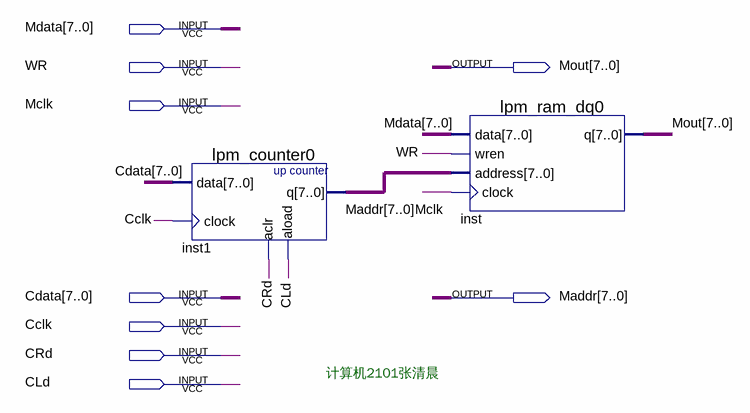
[diagram p0: schematic sheet]
// Quartus schematic RAM.bdf as structural Verilog: 2 symbols, 9 pins
module RAM (
  input  [7:0] Mdata,
  input  WR,
  input  Mclk,
  input  [7:0] Cdata,
  input  Cclk,
  input  CRd,
  input  CLd,
  output [7:0] Mout,
  output [7:0] Maddr
);

  lpm_counter0 inst1 (.data(Cdata), .clock(Cclk), .aclr(CRd), .aload(CLd), .q(Maddr));
  lpm_ram_dq0 inst (.data(Mdata), .wren(WR), .address(Maddr), .clock(Mclk), .q(Mout));

  // Notes on the sheet:
  //   计算机2101张清晨
endmodule
